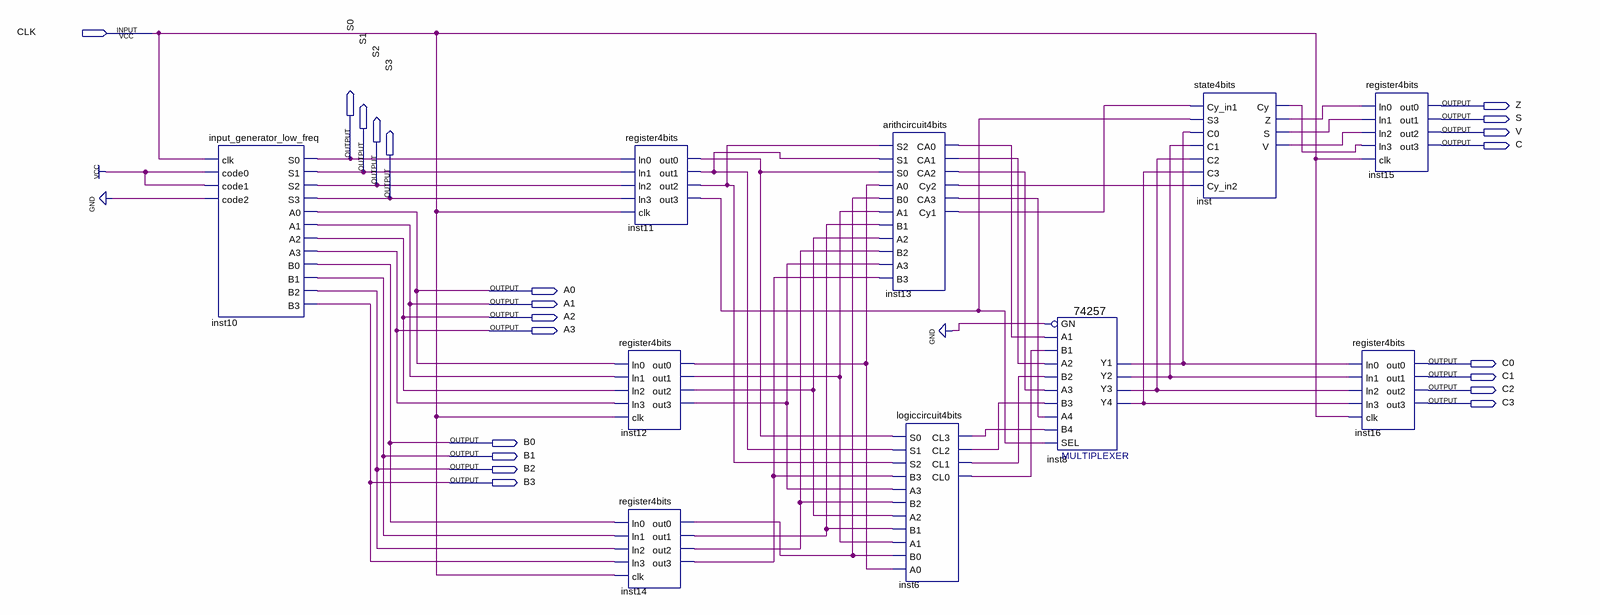
[diagram p0: schematic sheet]
// Quartus schematic Lab3top.bdf as structural Verilog: 10 symbols, 21 pins
module Lab3top (
  input  CLK,
  output Z,
  output S,
  output V,
  output C,
  output S0,
  output S1,
  output S2,
  output S3,
  output A0,
  output A1,
  output A2,
  output A3,
  output C0,
  output C1,
  output C2,
  output C3,
  output B0,
  output B1,
  output B2,
  output B3
);

  wire inst6_cl0, inst6_cl1, inst6_cl2, inst6_cl3, inst8_y1, inst8_y2, inst8_y3, inst8_y4, inst11_out0,
       inst11_out1, inst11_out2, inst11_out3, inst12_out0, inst12_out1, inst12_out2, inst12_out3, inst13_ca0,
       inst13_ca1, inst13_ca2, inst13_ca3, inst13_cy1, inst13_cy2, inst14_out0, inst14_out1, inst14_out2,
       inst14_out3, inst_cy, inst_s, inst_v, inst_z;

  input_generator_low_freq inst10 (
    .clk(CLK), .code0(1'b1), .code1(1'b1), .code2(1'b0), .S0(S0), .S1(S1), .S2(S2), .S3(S3), .A0(A0),
    .A1(A1), .A2(A2), .A3(A3), .B0(B0), .B1(B1), .B2(B2), .B3(B3));
  register4bits inst11 (
    .ln0(S0), .ln1(S1), .ln2(S2), .ln3(S3), .clk(CLK), .out0(inst11_out0), .out1(inst11_out1),
    .out2(inst11_out2), .out3(inst11_out3));
  register4bits inst12 (
    .ln0(A0), .ln1(A1), .ln2(A2), .ln3(A3), .clk(CLK), .out0(inst12_out0), .out1(inst12_out1),
    .out2(inst12_out2), .out3(inst12_out3));
  register4bits inst14 (
    .ln0(B0), .ln1(B1), .ln2(B2), .ln3(B3), .clk(CLK), .out0(inst14_out0), .out1(inst14_out1),
    .out2(inst14_out2), .out3(inst14_out3));
  arithcircuit4bits inst13 (
    .S2(inst11_out2), .S1(inst11_out1), .S0(inst11_out0), .A0(inst12_out0), .B0(inst14_out0),
    .A1(inst12_out1), .B1(inst14_out1), .A2(inst12_out2), .B2(inst14_out2), .A3(inst12_out3),
    .B3(inst14_out3), .CA0(inst13_ca0), .CA1(inst13_ca1), .CA2(inst13_ca2), .Cy2(inst13_cy2),
    .CA3(inst13_ca3), .Cy1(inst13_cy1));
  logiccircuit4bits inst6 (
    .S0(inst11_out0), .S1(inst11_out1), .S2(inst11_out2), .B3(inst14_out3), .A3(inst12_out3),
    .B2(inst14_out2), .A2(inst12_out2), .B1(inst14_out1), .A1(inst12_out1), .B0(inst14_out0),
    .A0(inst12_out0), .CL3(inst6_cl3), .CL2(inst6_cl2), .CL1(inst6_cl1), .CL0(inst6_cl0));
  \74257  inst8 (
    .B1(inst6_cl0), .A1(inst13_ca0), .B3(inst6_cl2), .A2(inst13_ca1), .B2(inst6_cl1), .A3(inst13_ca2),
    .A4(inst13_ca3), .B4(inst6_cl3), .SEL(inst11_out3), .GN(1'b0), .Y2(inst8_y2), .Y3(inst8_y3),
    .Y4(inst8_y4), .Y1(inst8_y1));
  state4bits inst (
    .Cy_in1(inst13_cy1), .S3(inst11_out3), .C0(inst8_y1), .C1(inst8_y2), .C2(inst8_y3), .C3(inst8_y4),
    .Cy_in2(inst13_cy2), .Cy(inst_cy), .Z(inst_z), .S(inst_s), .V(inst_v));
  register4bits inst15 (
    .ln0(inst_z), .ln1(inst_s), .ln2(inst_v), .ln3(inst_cy), .clk(CLK), .out0(Z), .out1(S), .out2(V), .out3(C));
  register4bits inst16 (
    .ln0(inst8_y1), .ln1(inst8_y2), .ln2(inst8_y3), .ln3(inst8_y4), .clk(CLK), .out0(C0), .out1(C1),
    .out2(C2), .out3(C3));
endmodule
